# Altium project OLED_SPI_PCB_Project.PrjPcb
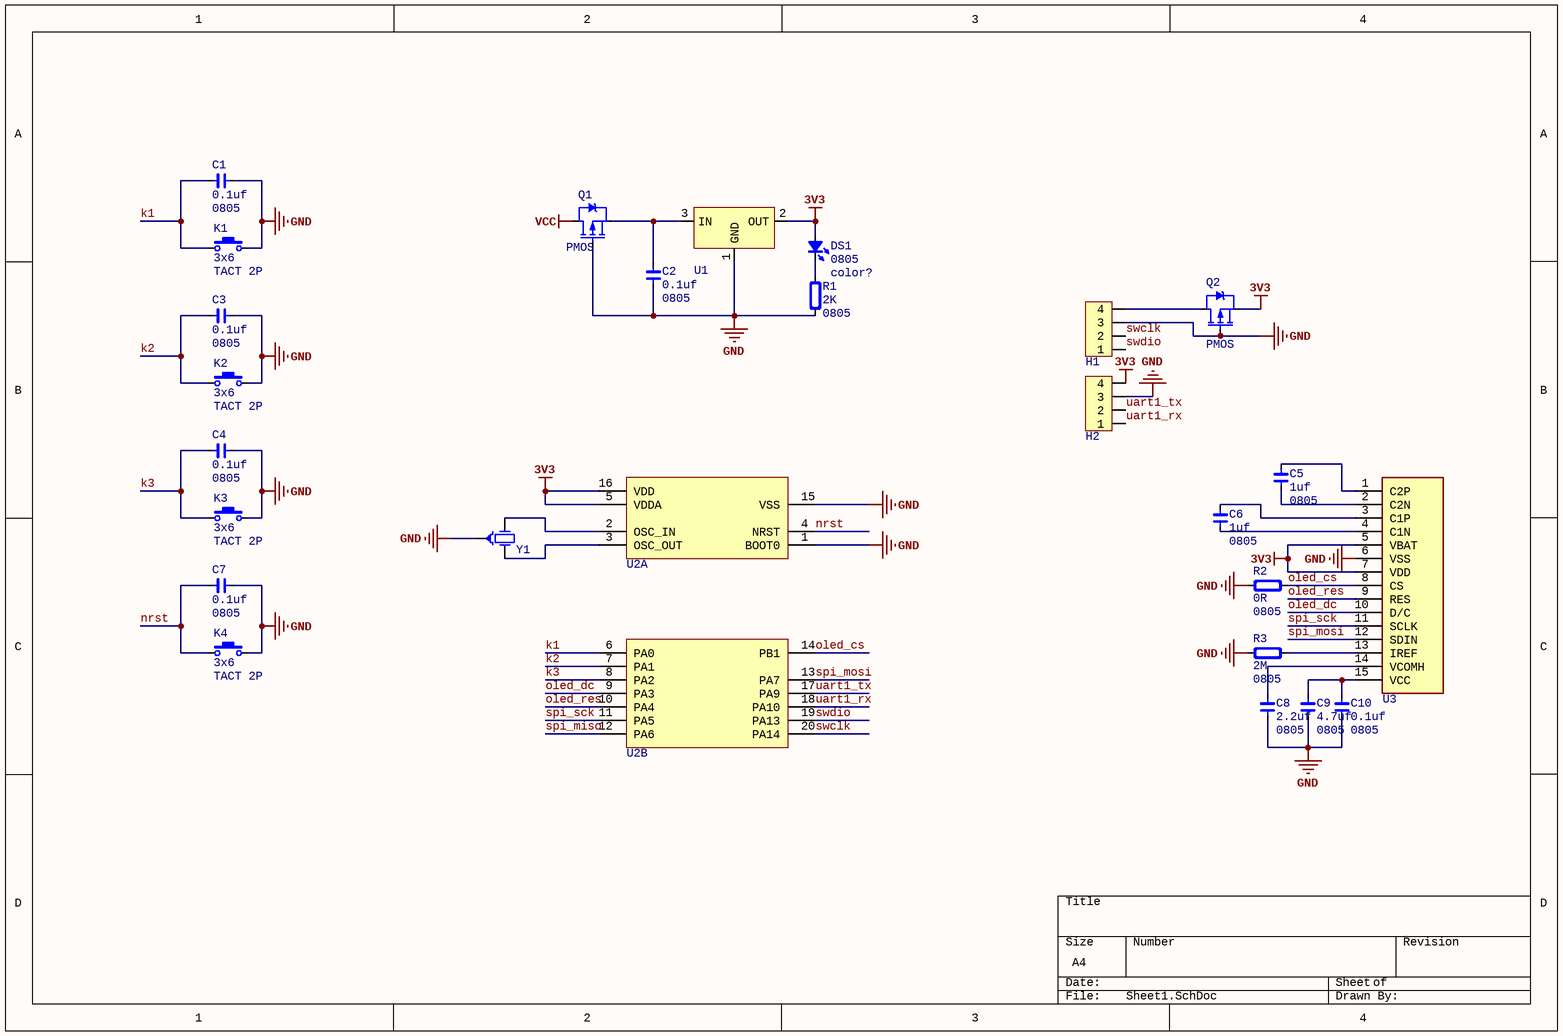
[diagram p0: Sheet1.SchDoc]
1 sheet, 26 parts. Net scope: global (net labels, ports and power ports of the same name join across sheets).
Board file: PCB1.PcbDoc

## Sheet Sheet1.SchDoc
size A4

### Parts
C1  value 0.1uf  Type: 0805  [CAP_0805]  (hidden comment: HDR2x10_2.54)
C2  value 0.1uf  Type: 0805  [CAP_0805]  (hidden comment: HDR2x10_2.54)
C3  value 0.1uf  Type: 0805  [CAP_0805]  (hidden comment: HDR2x10_2.54)
C4  value 0.1uf  Type: 0805  [CAP_0805]  (hidden comment: HDR2x10_2.54)
C5  value 1uf  Type: 0805  [CAP_0805]  (hidden comment: HDR2x10_2.54)
C6  value 1uf  Type: 0805  [CAP_0805]  (hidden comment: HDR2x10_2.54)
C7  value 0.1uf  Type: 0805  [CAP_0805]  (hidden comment: HDR2x10_2.54)
C8  value 2.2uf  Type: 0805  [CAP_0805]  (hidden comment: HDR2x10_2.54)
C9  value 4.7uf  Type: 0805  [CAP_0805]  (hidden comment: HDR2x10_2.54)
C10  value 0.1uf  Type: 0805  [CAP_0805]  (hidden comment: HDR2x10_2.54)
DS1  value color?  Type: 0805  [LED_0805_RED]  (hidden comment: HDR2x10_2.54)
H1  HDR2x10_2.54  [HDR1x4_2.54_180]  (value not drawn)
H2  HDR2x10_2.54  [HDR1x4_2.54_180]  (value not drawn)
K1  value 3x6  type: TACT 2P  [ButtonTACT_3x6x2.5_180]  (hidden comment: HDR2x10_2.54)
K2  value 3x6  type: TACT 2P  [ButtonTACT_3x6x2.5_180]  (hidden comment: HDR2x10_2.54)
K3  value 3x6  type: TACT 2P  [ButtonTACT_3x6x2.5_180]  (hidden comment: HDR2x10_2.54)
K4  value 3x6  type: TACT 2P  [ButtonTACT_3x6x2.5_180]  (hidden comment: HDR2x10_2.54)
Q1  value PMOS  [SOT23-3]  (hidden comment: HDR2x10_2.54)
Q2  value PMOS  [SOT23-3]  (hidden comment: HDR2x10_2.54)
R1  value 2K  Type: 0805  [RES_0805]  (hidden comment: HDR2x10_2.54)
R2  value 0R  Type: 0805  [RES_0805]  (hidden comment: HDR2x10_2.54)
R3  value 2M  Type: 0805  [RES_0805]  (hidden comment: HDR2x10_2.54)
U1  HDR2x10_2.54  [SOT23-3]  (value not drawn)
U2  HDR2x10_2.54  [TSSOP_E170_P0.65_20]  (value not drawn)  (parts A,B of 2)
U3  HDR2x10_2.54  [OLED_0.91_128X64_SSD1306]  (value not drawn)
Y1  HDR2x10_2.54  [XTAL_3P_CSTCE_8M_3.2*1.3]  (value not drawn)

### Nets
3V3: DS1.1(A) H2.4 Q2.2(S) U1.2(OUT) U2.5(VDDA) U2.16(VDD) U3.5(VBAT) U3.7(VDD)
GND: C1.2 C2.1 C3.2 C4.2 C7.2 C8.2 C9.2 C10.2 H1.3 H2.3 K1.2 K2.2 K3.2 K4.2 Q1.1(G) Q2.1(G) R1.1 R2.2 R3.2 U1.1(GND) U2.1(BOOT0) U2.15(VSS) U3.6(VSS) Y1.2(GND)
VCC: Q1.3(D)
k1: C1.1 K1.1 U2.6(PA0)
k2: C3.1 K2.1 U2.7(PA1)
k3: C4.1 K3.1 U2.8(PA2)
nrst: C7.1 K4.1 U2.4(NRST)
oled_cs: R2.1 U2.14(PB1) U3.8(CS)
oled_dc: U2.9(PA3) U3.10(D/C)
oled_res: U2.10(PA4) U3.9(RES)
spi_miso: U2.12(PA6)
spi_mosi: U2.13(PA7) U3.12(SDIN)
spi_sck: U2.11(PA5) U3.11(SCLK)
swclk: H1.2 U2.20(PA14)
swdio: H1.1 U2.19(PA13)
uart1_rx: H2.1 U2.18(PA10)
uart1_tx: H2.2 U2.17(PA9)
NetC2_2: C2.2 Q1.2(S) U1.3(IN)
NetC5_1: C5.1 U3.1(C2P)
NetC5_2: C5.2 U3.2(C2N)
NetC6_1: C6.1 U3.3(C1P)
NetC6_2: C6.2 U3.4(C1N)
NetC8_1: C8.1 U3.14(VCOMH)
NetC9_1: C9.1 C10.1 U3.15(VCC)
NetDS1_2: DS1.2(K) R1.2
NetH1_4: H1.4 Q2.3(D)
NetR3_1: R3.1 U3.13(IREF)
NetU2_2: U2.2(OSC_IN) Y1.1(OSC1)
NetU2_3: U2.3(OSC_OUT) Y1.3(OSC2)

### Library data of the parts
C1-C10 = Cap_0805: Capacitor; Specification: X7R 50V; Manufacturer: *
DS1 = LED_0805: LED
H1 H2 = HDR1x4_2.54: Header
K1-K4 = ButtonTACT_3x6x2.5_180: Button
Q1 Q2 = MOSFET_P_SOT23: MOSFET
R1-R3 = Res_0805: Resistor; Specification: ±5%; Manufacturer: *
U1 = XC6206: Power
U2 = STM32F03xF: MCU
U3 = OLED_0.91_SSD1306: OLED
Y1 = XTAL-3PIN: murata CSTCE 8M 3.2*1.3